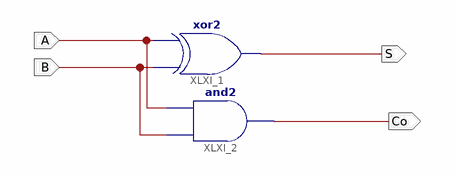
[diagram p0: schematic sheet 1]
// Xilinx ISE schematic HA.sch (artix7) as structural Verilog: 2 symbols, 4 ports
module HA (
  input  A,
  input  B,
  output S,
  output Co
);

  xor XLXI_1 (S, B, A);
  and XLXI_2 (Co, B, A);
endmodule
